# Altium schematic sheet gateway.SchDoc
size A3
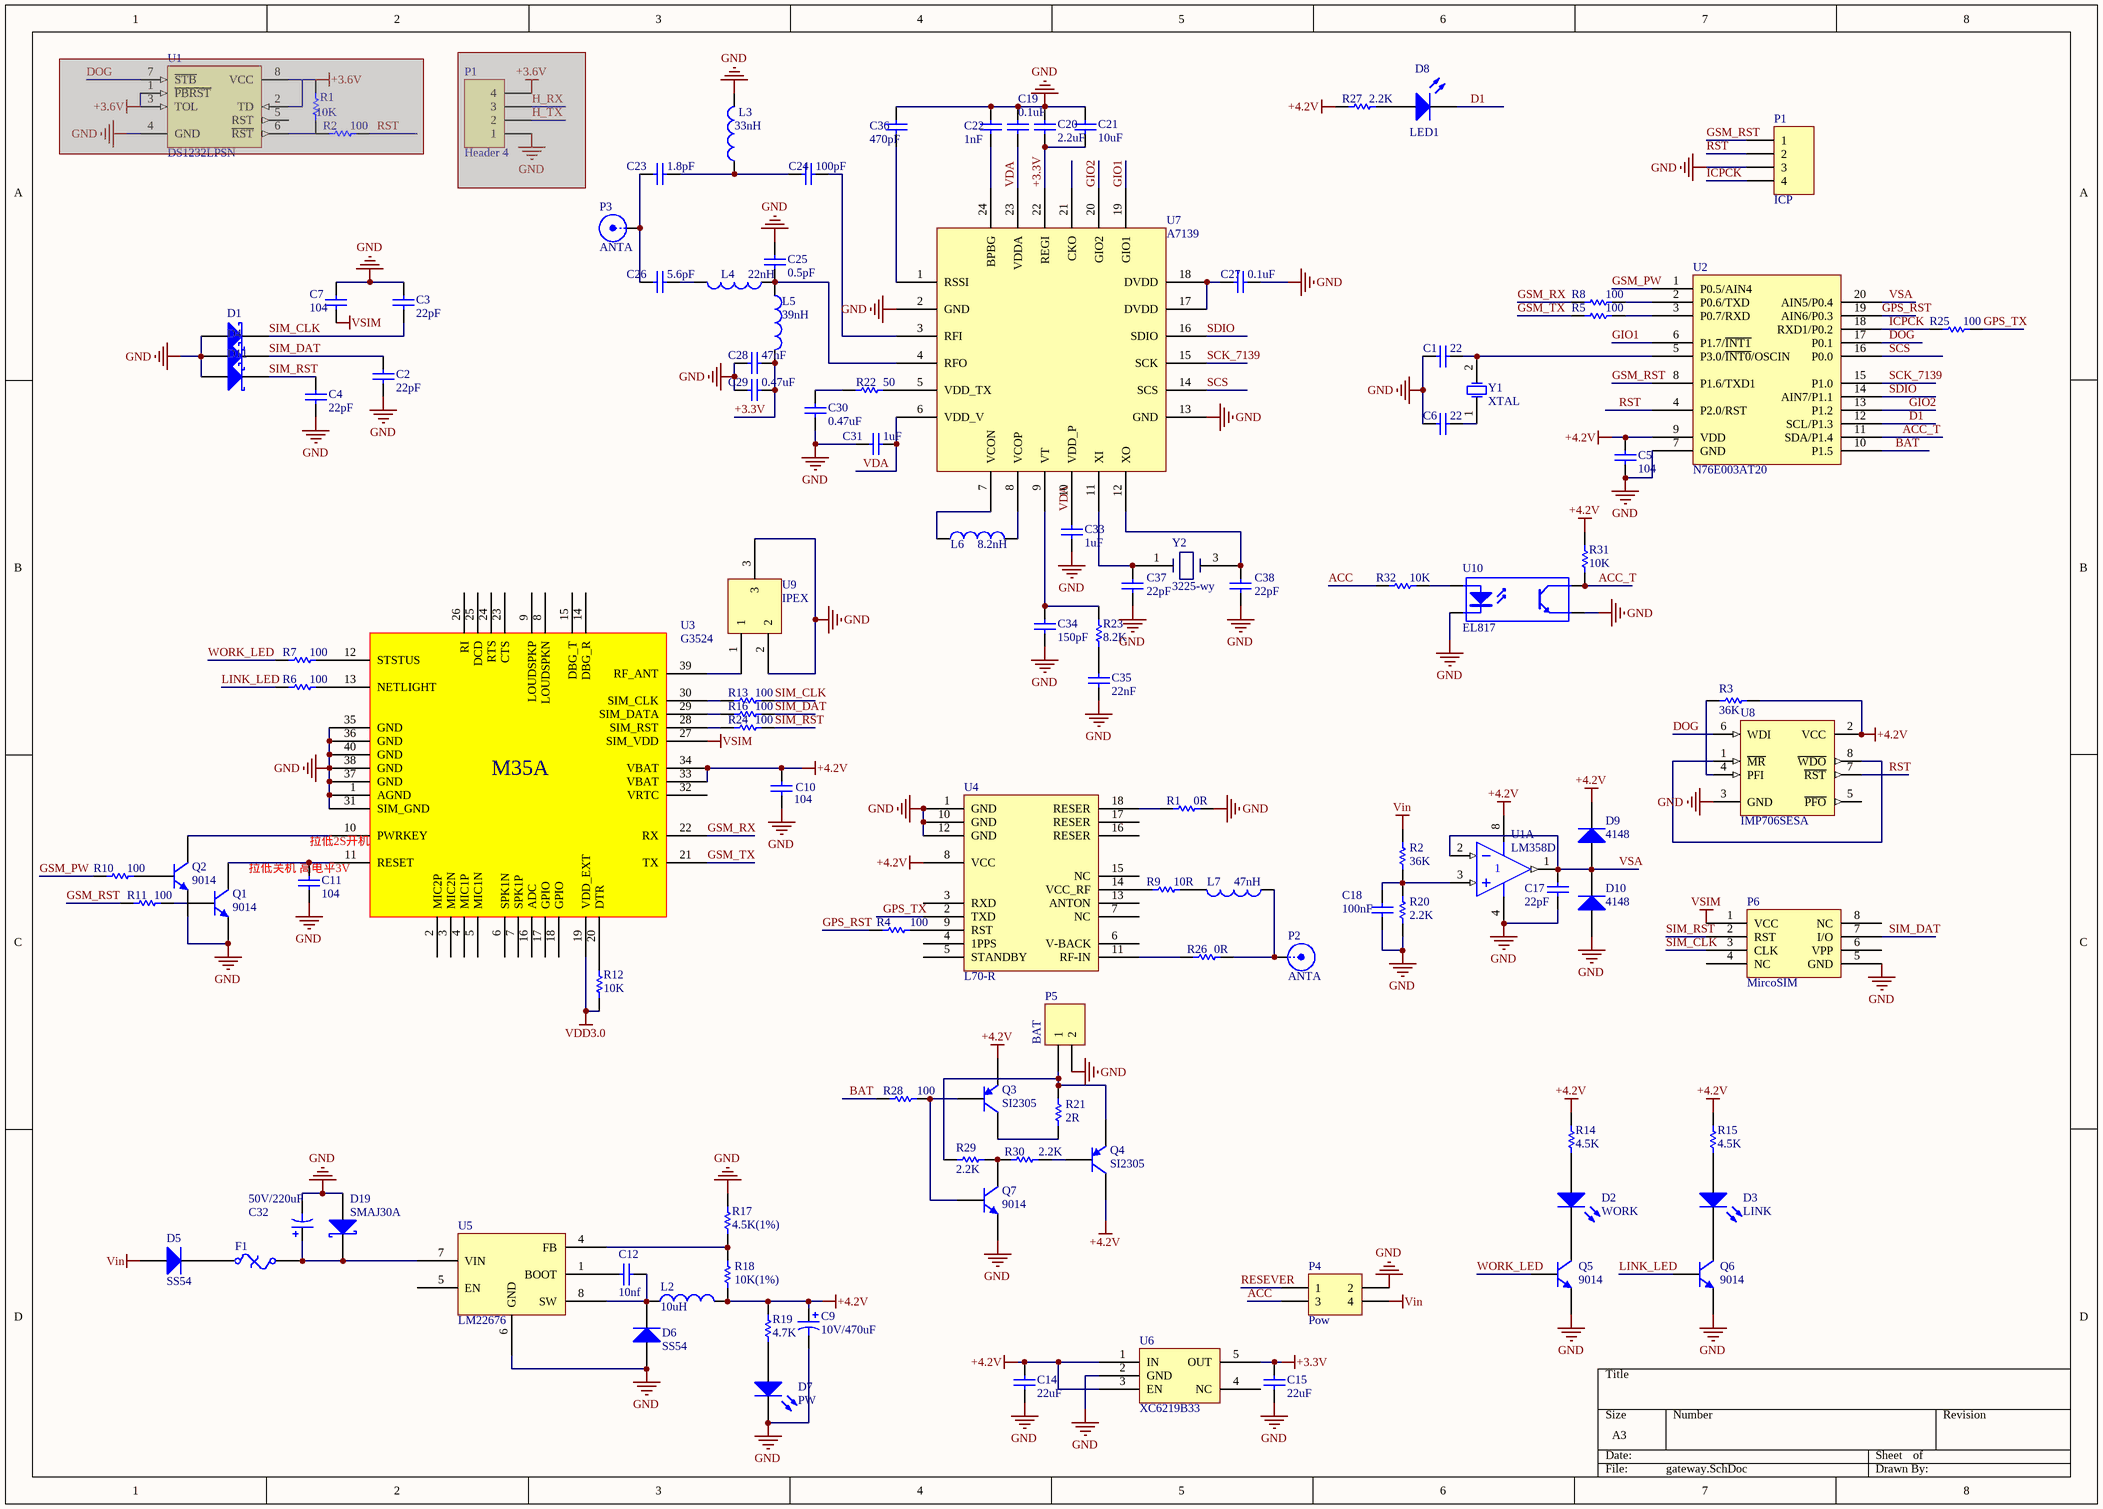
[diagram p0: gateway.SchDoc]

## Parts
(Parts that share a designator on the sheet are numbered #1, #2 ... from top to bottom, then left to right.)
C1  value 22  [0603]  (hidden comment: Cap)
C2  value 22pF  [0603]  (hidden comment: Cap)
C3  value 22pF  [0603]  (hidden comment: Cap)
C4  value 22pF  [0603]  (hidden comment: Cap)
C5  value 104  [0603]  (hidden comment: Cap)
C6  value 22  [0603]  (hidden comment: Cap)
C7  value 104  [0603]  (hidden comment: Cap)
C9  value 10V/470uF  [C8x10-SMD]  (hidden comment: Cap Pol3)
C10  value 104  [0603]  (hidden comment: Cap)
C11  value 104  [0603]  (hidden comment: Cap)
C12  value 10nf  [0603]  (hidden comment: Cap)
C14  value 22uF  [R0805]  (hidden comment: Cap)
C15  value 22uF  [R0805]  (hidden comment: Cap)
C17  value 22pF  [0603]  (hidden comment: Cap)
C18  value 100nF  [0603]  (hidden comment: Cap)
C19  value 0.1uF  [0402-A]  (hidden comment: Cap)
C20  value 2.2uF  [0603]  (hidden comment: Cap)
C21  value 10uF  [0603]  (hidden comment: Cap)
C22  value 1nF  [0402-A]  (hidden comment: Cap)
C23  value 1.8pF  [0402-A]  (hidden comment: Cap)
C24  value 100pF  [0402-A]  (hidden comment: Cap)
C25  value 0.5pF  [0402-A]  (hidden comment: Cap)
C26  value 5.6pF  [0402-A]  (hidden comment: Cap)
C27  value 0.1uF  [0402-A]  (hidden comment: Cap)
C28  value 47nF  [0402-A]  (hidden comment: Cap)
C29  value 0.47uF  [0402-A]  (hidden comment: Cap)
C30  value 0.47uF  [0402-A]  (hidden comment: Cap)
C31  value 1uF  [0402-A]  (hidden comment: Cap)
C32  value 50V/220uF  [C10-SMD]  (hidden comment: Cap Pol3)
C33  value 1uF  [0402-A]  (hidden comment: Cap)
C34  value 150pF  [0402-A]  (hidden comment: Cap)
C35  value 22nF  [0402-A]  (hidden comment: Cap)
C36  value 470pF  [0402-A]  (hidden comment: Cap)
C37  value 22pF  [0402-A]  (hidden comment: Cap)
C38  value 22pF  [0402-A]  (hidden comment: Cap)
D1  RL0603E012M015K  [0603]  (value not drawn)
D2  WORK  [0603-LED]
D3  LINK  [0603-LED]
D4  RL0603E012M015K  [0603]  (value not drawn)
D5  SS54  [SMA]
D6  SS54  [SMA]
D7  PW  [0603-LED]
D8  LED1  [0603-LED]
D9  4148  [LL34]
D10  4148  [LL34]
D11  RL0603E012M015K  [0603]  (value not drawn)
D19  SMAJ30A  [SMA]
F1  Fuse Thermal  [PPTC-5.8]  (value not drawn)
L2  value 10uH  [L-6045]  (hidden comment: Inductor)
L3  value 33nH  [0603]  (hidden comment: Inductor)
L4  value 22nH  [0603]  (hidden comment: Inductor)
L5  value 39nH  [0603]  (hidden comment: Inductor)
L6  value 8.2nH  [0402-A]  (hidden comment: Inductor)
L7  value 47nH  [0603]  (hidden comment: Inductor)
P1#1  ICP  [HDR1X4]
P1#2  Header 4  [HDR1X4]  (masked out: inside a compile mask, not in the netlist)
P2  ANTA  [SMB_V-RJ45]
P3  ANTA  [SMB_V-RJ45]
P4  Pow  [5569]
P5  BAT  [PH2.0-2P]
P6  MircoSIM  [Micro SIM]
Q1  value 9014  [SOT-23-NPN]  (hidden comment: NPN)
Q2  value 9014  [SOT-23-NPN]  (hidden comment: NPN)
Q3  value SI2305  [SOT-23-PNP]  (hidden comment: PNP)
Q4  value SI2305  [SOT-23-PNP]  (hidden comment: PNP)
Q5  value 9014  [SOT-23-NPN]  (hidden comment: NPN)
Q6  value 9014  [SOT-23-NPN]  (hidden comment: NPN)
Q7  value 9014  [SOT-23-NPN]  (hidden comment: NPN)
R1#1  value 10K  [0603]  (hidden comment: Res1)  (masked out: inside a compile mask, not in the netlist)
R1#2  value 0R  [0603]  (hidden comment: Res1)
R2#1  value 100  [0603]  (hidden comment: Res1)  (masked out: inside a compile mask, not in the netlist)
R2#2  value 36K  [0603]  (hidden comment: Res1)
R3  value 36K  [0603]  (hidden comment: Res1)
R4  value 100  [0603]  (hidden comment: Res1)
R5  value 100  [0603]  (hidden comment: Res1)
R6  value 100  [0603]  (hidden comment: Res1)
R7  value 100  [0603]  (hidden comment: Res1)
R8  value 100  [0603]  (hidden comment: Res1)
R9  value 10R  [0603]  (hidden comment: Res1)
R10  value 100  [0603]  (hidden comment: Res1)
R11  value 100  [0603]  (hidden comment: Res1)
R12  value 10K  [0603]  (hidden comment: Res1)
R13  value 100  [0603]  (hidden comment: Res1)
R14  value 4.5K  [0603]  (hidden comment: Res1)
R15  value 4.5K  [0603]  (hidden comment: Res1)
R16  value 100  [0603]  (hidden comment: Res1)
R17  value 4.5K(1%)  [0603]  (hidden comment: Res1)
R18  value 10K(1%)  [0603]  (hidden comment: Res1)
R19  value 4.7K  [0603]  (hidden comment: Res1)
R20  value 2.2K  [0603]  (hidden comment: Res1)
R21  value 2R  [3216[1206]]  (hidden comment: Res1)
R22  value 50  [0402-A]  (hidden comment: Res1)
R23  value 8.2K  [0402-A]  (hidden comment: Res1)
R24  value 100  [0603]  (hidden comment: Res1)
R25  value 100  [0603]  (hidden comment: Res1)
R26  value 0R  [0603]  (hidden comment: Res1)
R27  value 2.2K  [0603]  (hidden comment: Res1)
R28  value 100  [0603]  (hidden comment: Res1)
R29  value 2.2K  [0603]  (hidden comment: Res1)
R30  value 2.2K  [0603]  (hidden comment: Res1)
R31  value 10K  [0603]  (hidden comment: Res1)
R32  value 10K  [0603]  (hidden comment: Res1)
U1#1  value DS1232LPSN  [SOIC8]  (hidden comment: DS1232)  (masked out: inside a compile mask, not in the netlist)
U1#2  LM358D  [SOIC8]  (part A of 2)
U2  N76E003AT20  [TSSOP20]
U3  G3524  [G3524]
U4  L70-R  [L-70R]
U5  LM22676  [SOP8-POW]
U6  XC6219B33  [SOT23-5N]
U7  A7139  [QFN24N]
U8  IMP706SESA  [SOIC8]
U9  IPEX  [IPEX]
U10  EL817  [PCBComponent_1]
Y1  XTAL  [49SD]
Y2  3225-wy

## Nets
+3.3V: C15.1 C20.1 C21.1 C28.2 C29.2 L5.2 U6.5(OUT) U7.22(REGI)
+4.2V: C5.1 C9.1 C10.2 C14.1 D9.2(K) L2.2 Q3.1(E) Q4.3(C) R3.2 R14.1 R15.1 R18.1 R19.1 R27.2 R31.2 U1#2.8(V+) U2.9(VDD) U3.33(VBAT) U3.34(VBAT) U4.8(VCC) U6.1(IN) U6.3(EN) U8.2(VCC)
GND: C1.2 C2.2 C3.1 C4.2 C5.2 C6.2 C7.1 C9.2 C10.1 C11.2 C14.2 C15.2 C17.1 C18.2 C19.2 C20.2 C21.2 C22.2 C25.2 C27.2 C28.1 C29.1 C30.1 C31.2 C32.2 C33.1 C34.1 C35.2 C36.2 C37.1 C38.1 D1.2(A) D4.2(A) D6.1(A) D7.2(K) D10.1(A) D11.2(A) D19.2(A) L3.2 P1#1.3 P2.2(Y) P3.2(Y) P4.2 P5.2 P6.5(GND) Q1.1(E) Q2.1(E) Q5.1(E) Q6.1(E) Q7.1(E) R1#2.1 R17.1 R20.1 U1#2.4(V-) U2.7(GND) U3.1(AGND) U3.31(SIM_GND) U3.35(GND) U3.36(GND) U3.37(GND) U3.38(GND) U3.40(GND) U4.1(GND) U4.10(GND) U4.12(GND) U5.6(GND) U5.9 U6.2(GND) U7.2(GND) U7.13(GND) U7.25(GND) U8.3(GND) U9.2 U9.3 U10.2(K) U10.3(E)
VDD3.0: R12.2 U3.19(VDD_EXT)
Vin: D5.1(A) P4.4 R2#2.2
VSIM: C7.2 P6.1(VCC) U3.27(SIM_VDD)
ACC: P4.3 R32.1
ACC_T: R31.1 U2.11(SDA/P1.4) U10.4(C)
BAT: R28.2 U2.10(P1.5)
D1: D8.2(K) U2.12(SCL/P1.3)
DOG: U2.17(P0.1) U8.6(WDI)
GIO1: U2.6(P1.7/~{INT1}) U7.19(GIO1)
GIO2: U2.13(P1.2) U7.20(GIO2)
GPS_RST: R4.1 U2.19(AIN6/P0.3)
GPS_TX: R25.2 U4.2(TXD)
GSM_PW: R10.2 U2.1(P0.5/AIN4)
GSM_RST: P1#1.1 R11.2 U2.8(P1.6/TXD1)
GSM_RX: R8.1 U3.22(RX)
GSM_TX: R5.1 U3.21(TX)
ICPCK: P1#1.4 R25.1 U2.18(RXD1/P0.2)
LINK_LED: Q6.2(B) R6.2
RESEVER: P4.1
RST: P1#1.2 U2.4(P2.0/RST) U8.7(~{RST})
SCK_7139: U2.15(P1.0) U7.15(SCK)
SCS: U2.16(P0.0) U7.14(SCS)
SDIO: U2.14(AIN7/P1.1) U7.16(SDIO)
SIM_CLK: C3.2 D1.1(K) P6.3(CLK) R13.1
SIM_DAT: C2.1 D4.1(K) P6.7(I/O) R16.1
SIM_RST: C4.1 D11.1(K) P6.2(RST) R24.1
VDA: C19.1 C31.1 C33.2 U7.6(VDD_V) U7.10(VDD_P) U7.23(VDDA)
VSA: C17.2 D9.1(A) D10.2(K) U1#2.1(OUT) U1#2.2(IN-) U2.20(AIN5/P0.4)
WORK_LED: Q5.2(B) R7.2
NetC1_1: C1.1 U2.5(P3.0/~{INT0}/OSCIN) Y1.2(OSC2)
NetC6_1: C6.1 Y1.1(OSC1)
NetC11_1: C11.1 Q1.3(C) U3.11(RESET)
NetC12_1: C12.1 D6.2(K) L2.1 U5.8(SW)
NetC12_2: C12.2 U5.1(BOOT)
NetC18_1: C18.1 R2#2.1 R20.2 U1#2.3(IN+)
NetC22_1: C22.1 U7.24(BPBG)
NetC23_1: C23.1 C24.2 L3.1
NetC23_2: C23.2 C26.2 P3.1(X)
NetC24_1: C24.1 U7.3(RFI)
NetC25_1: C25.1 L4.1 L5.1 U7.4(RFO)
NetC26_1: C26.1 L4.2
NetC27_1: C27.1 U7.17(DVDD) U7.18(DVDD)
NetC30_2: C30.2 R22.2
NetC32_1: C32.1 D19.1(K) F1.2 U5.7(VIN)
NetC34_2: C34.2 R23.2 U7.9(VT)
NetC35_1: C35.1 R23.1
NetC36_1: C36.1 U7.1(RSSI)
NetC37_2: C37.2 U7.11(XI) Y2.1
NetC38_2: C38.2 U7.12(XO) Y2.3
NetD2_1: D2.1(A) R14.2
NetD2_2: D2.2(K) Q5.3(C)
NetD3_1: D3.1(A) R15.2
NetD3_2: D3.2(K) Q6.3(C)
NetD5_2: D5.2(K) F1.1
NetD7_1: D7.1(A) R19.2
NetD8_1: D8.1(A) R27.1
NetL6_1: L6.1 U7.7(VCON)
NetL6_2: L6.2 U7.8(VCOP)
NetL7_1: L7.1 P2.1(X) R26.1
NetL7_2: L7.2 R9.1
NetP5_1: P5.1 Q4.1(E) R21.2 R29.1
NetQ1_2: Q1.2(B) R11.1
NetQ2_2: Q2.2(B) R10.1
NetQ2_3: Q2.3(C) U3.10(PWRKEY)
NetQ3_2: Q3.2(B) Q7.2(B) R28.1
NetQ3_3: Q3.3(C) R21.1
NetQ4_2: Q4.2(B) R30.1
NetQ7_3: Q7.3(C) R29.2 R30.2
NetR1#2_2: R1#2.2 U4.18(RESER)
NetR3_1: R3.1 U8.4(PFI)
NetR4_2: R4.2 U4.9(RST)
NetR5_2: R5.2 U2.3(P0.7/RXD)
NetR6_1: R6.1 U3.13(NETLIGHT)
NetR7_1: R7.1 U3.12(STSTUS)
NetR8_2: R8.2 U2.2(P0.6/TXD)
NetR9_2: R9.2 U4.14(VCC_RF)
NetR12_1: R12.1 U3.20(DTR)
NetR13_2: R13.2 U3.30(SIM_CLK)
NetR16_2: R16.2 U3.29(SIM_DATA)
NetR17_2: R17.2 R18.2 U5.4(FB)
NetR22_1: R22.1 U7.5(VDD_TX)
NetR24_2: R24.2 U3.28(SIM_RST)
NetR26_2: R26.2 U4.11(RF-IN)
NetR32_2: R32.2 U10.1(A)
NetU3_39: U3.39(RF_ANT) U9.1
NetU8_1: U8.1(~{MR}) U8.8(~{WDO})

Not connected (* = marked no-connect by the designer): P6 4(NC) 6(VPP) 8(NC); U3 2(MIC2P) 3(MIC2N) 4(MIC1P) 5(MIC1N) 6(SPK1N) 7(SPK1P) 8(LOUDSPKN) 9(LOUDSPKP) 14(DBG_R) 15(DBG_T) 16(ADC) 17(GPIO) 18(GPIO) 23(CTS) 24(RTS) 25(DCD) 26(RI) 32(VRTC); U4 3(RXD) 4(1PPS) 5(STANDBY) 6(V-BACK) 7(NC) 13(ANTON) 15(NC) 16(RESER) 17(RESER); U5 2(NC) 3(NC) 5(EN); U6 4(NC); U7 21(CKO); U8 5(~{PFO})

## Notes on the sheet
- 拉低2S开机
- (near C11) 拉低关机 高电平3V
- (in symbol G3524) M35A

## Library data of the parts
C1-C7 C10-C12 C14 C15 C17-C31 C33-C38 = Cap: Capacitor; Published: 8-Jun-2000; LatestRevisionDate: 17-Jul-2002; LatestRevisionNote: Re-released for DXP Platform.; PackageReference: RAD-0.3; Publisher: Altium Limited
C9 C32 = Cap Pol3: Polarized Capacitor (Surface Mount); Published: 8-Jun-2000; LatestRevisionDate: 17-Jul-2002; LatestRevisionNote: Re-released for DXP Platform.; PackageReference: C0805; Publisher: Altium Limited
D1 D4 D11 D19 = Diode 18TQ045: Schottky Rectifier; Note: Terminal 2 is the TAB and is electrically connected to the cathode; Value: SMBJ45CA; Published: 8-Jun-2000; LatestRevisionDate: 17-Jul-2002; LatestRevisionNote: Re-released for DXP Platform.; DatasheetDocument: Dec-1997; PackageDocument: Feb-1998; PackageReference: TO-220AC; Publisher: Altium Limited; ComponentLink1Description: Manufacturer Link; ComponentLink1URL: http://www.irf.com/; ComponentLink2Description: Datasheet; ComponentLink2URL: http://www.irf.com/product-info/datasheets/data/18tq.pdf
D2 D3 = LED2: Typical RED, GREEN, YELLOW, AMBER GaAs LED; Value: GRN; Published: 8-Jun-2000; LatestRevisionDate: 17-Jul-2002; LatestRevisionNote: Re-released for DXP Platform.; PackageDocument: Feb-2002; PackageReference: 3.2X1.6X1.1; Publisher: Altium Limited
D5 D6 = Diode 1N5408: 3 Amp Medium Power Silicon Rectifier Diode; Published: 8-Jun-2000; LatestRevisionDate: 17-Jul-2002; LatestRevisionNote: Re-released for DXP Platform.; DatasheetDocument: Aug-1984; PackageReference: DO-201AD; Publisher: Altium Limited; ComponentLink1Description: Manufacturer Link; ComponentLink1URL: http://www.irf.com/; Value: SS54
D7 = LED2: Typical RED, GREEN, YELLOW, AMBER GaAs LED; Published: 8-Jun-2000; LatestRevisionDate: 17-Jul-2002; LatestRevisionNote: Re-released for DXP Platform.; PackageDocument: Feb-2002; PackageReference: 3.2X1.6X1.1; Publisher: Altium Limited; Value: RED
D8 = LED1: Typical RED GaAs LED; Published: 8-Jun-2000; LatestRevisionDate: 08-Jul-2005; LatestRevisionNote: Mech Layer 1 removed.; PackageReference: LED-1; Publisher: Altium Limited
D9 D10 = Diode 1N5408: 3 Amp Medium Power Silicon Rectifier Diode; Value: 1N4148; Published: 8-Jun-2000; LatestRevisionDate: 17-Jul-2002; LatestRevisionNote: Re-released for DXP Platform.; DatasheetDocument: Aug-1984; PackageReference: DO-201AD; Publisher: Altium Limited; ComponentLink1Description: Manufacturer Link; ComponentLink1URL: http://www.irf.com/
F1 = Fuse Thermal: Thermal Fuse; Published: 24-Mar-1999; LatestRevisionDate: 17-Jul-2002; LatestRevisionNote: Re-released for DXP Platform.; PackageReference: PIN-W2/E2.8; Publisher: Altium Limited
L2-L7 = Inductor: Code_IEC: 1005; Published: 8-Jun-2000; LatestRevisionDate: 17-Jul-2002; LatestRevisionNote: Re-released for DXP Platform.; PackageReference: 0402-A; Publisher: Altium Limited; Code_JEITA: 0402
P1#1 P1#2 = Header 4: Header, 4-Pin; LatestRevisionDate: 17-Jul-2002; LatestRevisionNote: Re-released for DXP Platform.; Publisher: Altium Limited
P2 P3 = SMB: SMB Straight Connector; LatestRevisionDate: 17-Jul-2002; LatestRevisionNote: Re-released for DXP Platform.; Publisher: Altium Limited
P4 = Header 2X2: Header, 2-Pin, Dual row; LatestRevisionDate: 17-Jul-2002; LatestRevisionNote: Re-released for DXP Platform.; Publisher: Altium Limited
P5 = Header 2: Header, 2-Pin; LatestRevisionDate: 17-Jul-2002; LatestRevisionNote: Re-released for DXP Platform.; Publisher: Altium Limited
Q1 Q2 Q5-Q7 = 2N5551: NPN General Purpose Amplifier; Published: 8-Jun-2000; LatestRevisionDate: 17-Jan-2003; LatestRevisionNote: PCB Footprint 'BCY-W3/D4.7' replaced; DatasheetDocument: 1997; PackageDocument: Sep-1998; PackageReference: TO-92A; Publisher: Altium Limited; ComponentLink1Description: Manufacturer Link; ComponentLink1URL: http://www.fairchildsemi.com/; ComponentLink2Description: Datasheet; ComponentLink2URL: http://www.fairchildsemi.com/ds/2N%2F2N5551.pdf
Q3 Q4 = 2N5401: PNP General Purpose Amplifier; Published: 8-Jun-2000; LatestRevisionDate: 17-Jan-2003; LatestRevisionNote: PCB Footprint 'BCY-W3/D4.7' replaced; DatasheetDocument: 1997; PackageDocument: Sep-1998; PackageReference: TO-92A; Publisher: Altium Limited; ComponentLink1Description: Manufacturer Link; ComponentLink1URL: http://www.fairchildsemi.com/; ComponentLink2Description: Datasheet; ComponentLink2URL: http://www.fairchildsemi.com/ds/2N%2F2N5401.pdf
R1#1 R1#2 R2#1 R2#2 R3-R32 = Res1: Resistor; Published: 8-Jun-2000; LatestRevisionDate: 17-Jul-2002; LatestRevisionNote: Re-released for DXP Platform.; PackageReference: AXIAL-0.3; Publisher: Altium Limited
U1#1 = DS1232LPSN-2: Low-Power MicroMonitor Chip; Published: 13-Oct-2000; LatestRevisionDate: 13-Apr-2006; LatestRevisionNote: IPC-7351 Footprint Added.; DatasheetVersion: 26-Jun-1998; PackageVersion: 1999; PackageReference: SOIC8N; Publisher: Altium Limited; PackageDescription: 8-Pin Small Outline Integrated Circuit 1.27 mm Pitch; Code_IPC: SOIC127P600-8; ComponentLink1Description: Manufacturer Link; ComponentLink1URL: http://www.maxim-ic.com/; ComponentLink2Description: Datasheet; ComponentLink2URL: http://pdfserv.maxim-ic.com/en/ds/DS1232LP.pdf
U1#2 = LM358D: Dual Low-Power Operational Amplifier; Published: 17-Jul-2002; LatestRevisionDate: 13-Apr-2006; LatestRevisionNote: IPC-7351 Footprint Added.; DatasheetVersion: 1988; PackageReference: 751-02; Publisher: Altium Limited; PackageDescription: 8-Pin Small Outline Integrated Circuit 1.27 mm Pitch; Code_JEDEC: MS-012-AA; Code_IPC: SOIC127P600-8; ComponentLink1Description: Manufacturer Link; ComponentLink1URL: http://www.onsemi.com/site/products/parametrics/0,4446,251,00.html; ComponentLink2Description: Datasheet; ComponentLink2URL: http://www.onsemi.com/pub/Collateral/LM358-D.PDF
U5 = LM22676-5.0
U6 = LP5907: Value: LP5907
U8 = MAX706RCSA: +3V Voltage Monitoring, Low-Cost, 礟 Supervisory Circuit; Published: 16-Jan-2001; LatestRevisionDate: 13-Apr-2006; LatestRevisionNote: IPC-7351 Footprint Added.; DatasheetVersion: Sep-1995; PackageReference: NSO8; Publisher: Altium Limited; PackageDescription: 8-Pin Small Outline Integrated Circuit 1.27 mm Pitch; Code_JEDEC: MS-012-AA; Code_IPC: SOIC127P600-8; ComponentLink1Description: Manufacturer Link; ComponentLink1URL: http://www.maxim-ic.com/; ComponentLink2Description: Datasheet; ComponentLink2URL: http://pdfserv.maxim-ic.com/en/ds/MAX706P-MAX708T.pdf
U10 = Optoisolator1: 4-Pin Phototransistor Optocoupler; Published: 24-Mar-1999; LatestRevisionDate: 04-Mar-2005; LatestRevisionNote: Sch pins 3 & 4 Swapped.; DatasheetDocument: Nov-2003; PackageReference: DIP-4; Publisher: Altium Limited
Y1 = XTAL: Crystal Oscillator; Published: 8-Jun-2000; LatestRevisionDate: 17-Jul-2002; LatestRevisionNote: Re-released for DXP Platform.; PackageReference: R38; Publisher: Altium Limited